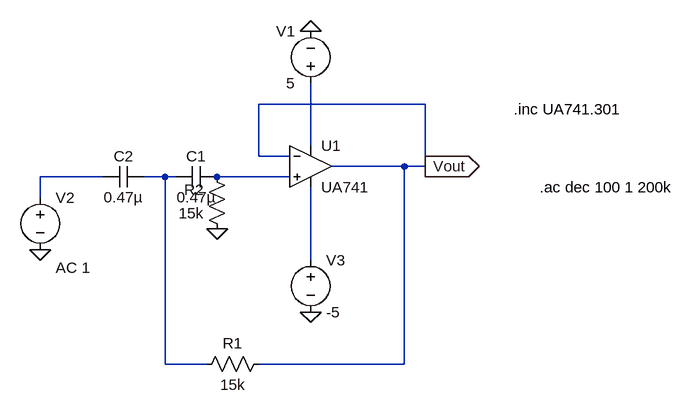
[diagram p0: schematic HP_Sallen_Key_20hz.asc]
HP_Sallen_Key_20hz.asc, the LTspice schematic file:
Version 4.1
SHEET 1 880 680
WIRE 384 -48 128 -48
WIRE 208 16 208 -80
WIRE 128 32 128 -48
WIRE 176 32 128 32
WIRE 352 48 240 48
WIRE 384 48 384 -48
WIRE 384 48 352 48
WIRE -112 64 -208 64
WIRE -16 64 -48 64
WIRE 0 64 -16 64
WIRE 176 64 64 64
WIRE -208 96 -208 64
WIRE 208 192 208 80
WIRE -16 352 -16 64
WIRE 48 352 -16 352
WIRE 352 352 352 48
WIRE 352 352 128 352
FLAG 208 -160 0
FLAG 208 272 0
FLAG 64 144 0
FLAG -208 176 0
FLAG 384 48 Vout
IOPIN 384 48 Out
SYMBOL OpAmps\\opamp2 208 -16 R0
SYMATTR InstName U1
SYMATTR Value UA741
SYMBOL voltage 208 -64 R180
WINDOW 0 24 96 Left 2
WINDOW 3 24 16 Left 2
WINDOW 123 0 0 Left 0
WINDOW 39 0 0 Left 0
SYMATTR InstName V1
SYMATTR Value 5
SYMBOL voltage -208 80 R0
WINDOW 123 24 124 Left 2
WINDOW 39 0 0 Left 0
SYMATTR InstName V2
SYMATTR Value ""
SYMATTR Value2 AC 1
SYMBOL voltage 208 176 R0
WINDOW 123 0 0 Left 0
WINDOW 39 0 0 Left 0
SYMATTR InstName V3
SYMATTR Value -5
SYMBOL res 144 336 R90
WINDOW 0 0 56 VBottom 2
WINDOW 3 32 56 VTop 2
SYMATTR InstName R1
SYMATTR Value 15k
SYMBOL res 80 160 R180
WINDOW 0 36 76 Left 2
WINDOW 3 36 40 Left 2
SYMATTR InstName R2
SYMATTR Value 15k
SYMBOL cap 64 48 R90
WINDOW 0 0 32 VBottom 2
WINDOW 3 32 32 VTop 2
SYMATTR InstName C1
SYMATTR Value 0.47µ
SYMBOL cap -48 48 R90
WINDOW 0 0 32 VBottom 2
WINDOW 3 32 32 VTop 2
SYMATTR InstName C2
SYMATTR Value 0.47µ
TEXT 520 -40 Left 2 !.inc UA741.301
TEXT 560 80 Left 2 !.ac dec 100 1 200k

The netlist it stands for:
* HP_Sallen_Key_20hz.asc
X§U1 N004 Vout N001 N005 Vout UA741  ; pins In+ In- V+ V- OUT
V1 N001 0 5
V2 N002 0 AC 1
V3 N005 0 -5
R1 Vout N003 15k
R2 0 N004 15k
C1 N004 N003 0.47µ
C2 N003 N002 0.47µ
.inc UA741.301
.ac dec 100 1 200k
.backanno
.end